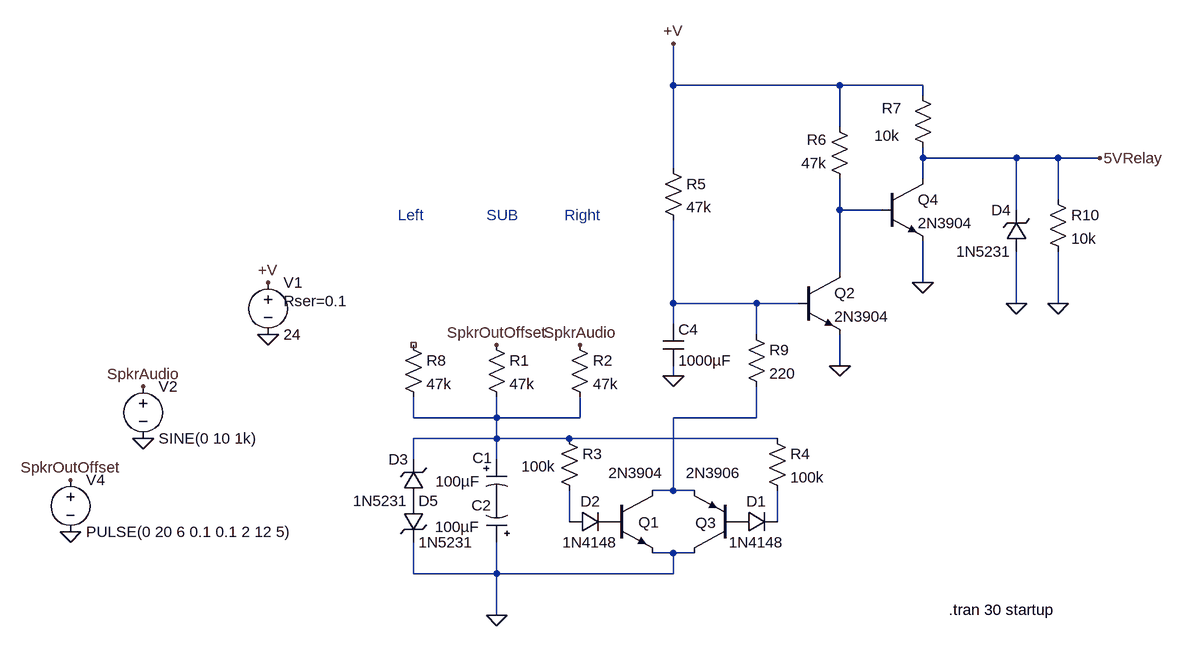
[diagram p0: schematic SpeakerProtection5vOut.asc]
SpeakerProtection5vOut.asc, the LTspice schematic file:
Version 4
SHEET 1 1752 680
WIRE 576 -688 576 -752
WIRE 832 -688 576 -688
WIRE 960 -688 832 -688
WIRE 960 -672 960 -688
WIRE 832 -624 832 -688
WIRE 960 -576 960 -592
WIRE 1104 -576 960 -576
WIRE 1168 -576 1104 -576
WIRE 1232 -576 1168 -576
WIRE 576 -560 576 -688
WIRE 960 -544 960 -576
WIRE 1168 -512 1168 -576
WIRE 832 -496 832 -544
WIRE 896 -496 832 -496
WIRE 1104 -496 1104 -576
WIRE 832 -400 832 -496
WIRE 960 -384 960 -448
WIRE 576 -352 576 -480
WIRE 704 -352 576 -352
WIRE 768 -352 704 -352
WIRE 1104 -352 1104 -432
WIRE 1168 -352 1168 -432
WIRE 576 -320 576 -352
WIRE 704 -304 704 -352
WIRE 832 -256 832 -304
WIRE 576 -240 576 -256
WIRE 176 -176 176 -208
WIRE 304 -176 304 -208
WIRE 304 -176 176 -176
WIRE 432 -176 432 -208
WIRE 432 -176 304 -176
WIRE 704 -176 704 -224
WIRE 704 -176 576 -176
WIRE 304 -144 304 -176
WIRE 304 -144 176 -144
WIRE 416 -144 304 -144
WIRE 736 -144 416 -144
WIRE 176 -112 176 -144
WIRE 304 -112 304 -144
WIRE 576 -64 576 -176
WIRE 576 -64 544 -64
WIRE 608 -64 576 -64
WIRE 416 -16 416 -64
WIRE 736 -16 736 -64
WIRE 576 32 544 32
WIRE 608 32 576 32
WIRE 176 64 176 16
WIRE 304 64 304 16
WIRE 304 64 176 64
WIRE 576 64 576 32
WIRE 576 64 304 64
WIRE 304 128 304 64
FLAG -48 -304 0
FLAG -48 -384 +V
FLAG -352 -80 SpkrOutOffset
FLAG 304 128 0
FLAG 576 -752 +V
FLAG 1232 -576 5VRelay
FLAG -352 0 0
FLAG 832 -256 0
FLAG 1104 -352 0
FLAG 960 -384 0
FLAG 304 -288 SpkrOutOffset
FLAG -240 -144 0
FLAG -240 -224 SpkrAudio
FLAG 432 -288 SpkrAudio
FLAG 1168 -352 0
FLAG 576 -240 0
SYMBOL voltage -48 -400 R0
WINDOW 123 0 0 Left 0
WINDOW 39 24 44 Left 2
SYMATTR SpiceLine Rser=0.1
SYMATTR InstName V1
SYMATTR Value 24
SYMBOL res 288 -304 R0
SYMATTR InstName R1
SYMATTR Value 47k
SYMBOL res 416 -304 R0
SYMATTR InstName R2
SYMATTR Value 47k
SYMBOL polcap 288 -112 R0
WINDOW 0 -21 -2 Left 2
WINDOW 3 -78 34 Left 2
SYMATTR InstName C1
SYMATTR Value 100µF
SYMATTR Description Capacitor
SYMATTR Type cap
SYMATTR SpiceLine V=100 Irms=385m Rser=0.18 Lser=0
SYMBOL polcap 320 16 R180
WINDOW 0 24 57 Left 2
WINDOW 3 42 24 Left 2
SYMATTR InstName C2
SYMATTR Value 100µF
SYMATTR Description Capacitor
SYMATTR Type cap
SYMATTR SpiceLine V=100 Irms=385m Rser=0.18 Lser=0
SYMBOL npn 480 -64 R0
WINDOW 0 42 49 Left 2
WINDOW 3 -4 -27 Left 2
SYMATTR InstName Q1
SYMATTR Value 2N3904
SYMBOL pnp 672 32 R180
WINDOW 0 30 46 Left 2
WINDOW 3 -8 123 Left 2
SYMATTR InstName Q3
SYMATTR Value 2N3906
SYMBOL res 400 -160 R0
WINDOW 3 -58 59 Left 2
SYMATTR Value 100k
SYMATTR InstName R3
SYMBOL res 720 -160 R0
SYMATTR InstName R4
SYMATTR Value 100k
SYMBOL diode 672 0 R270
WINDOW 0 32 32 VTop 2
WINDOW 3 0 32 VBottom 2
SYMATTR InstName D1
SYMATTR Value 1N4148
SYMBOL diode 416 0 R270
WINDOW 0 32 32 VTop 2
WINDOW 3 0 32 VBottom 2
SYMATTR InstName D2
SYMATTR Value 1N4148
SYMBOL res 560 -576 R0
SYMATTR InstName R5
SYMATTR Value 47k
SYMBOL voltage -352 -96 R0
WINDOW 123 0 0 Left 0
SYMATTR InstName V4
SYMATTR Value PULSE(0 20 6 0.1 0.1 2 12 5)
SYMATTR SpiceLine Rser=0.5
SYMBOL npn 768 -400 R0
SYMATTR InstName Q2
SYMATTR Value 2N3904
SYMBOL zener 1120 -432 R180
WINDOW 0 24 64 Left 2
WINDOW 3 24 0 Left 2
SYMATTR InstName D4
SYMATTR Value 1N5231
SYMATTR Description Diode
SYMATTR Type diode
SYMBOL res 848 -528 R180
WINDOW 0 36 76 Left 2
WINDOW 3 36 40 Left 2
SYMATTR InstName R6
SYMATTR Value 47k
SYMBOL npn 896 -544 R0
SYMATTR InstName Q4
SYMATTR Value 2N3904
SYMBOL res 944 -688 R0
WINDOW 0 -47 35 Left 2
WINDOW 3 -59 78 Left 2
SYMATTR InstName R7
SYMATTR Value 10k
SYMBOL voltage -240 -240 R0
WINDOW 123 0 0 Left 0
WINDOW 39 0 0 Left 0
SYMATTR InstName V2
SYMATTR Value SINE(0 10 1k)
SYMBOL res 160 -304 R0
SYMATTR InstName R8
SYMATTR Value 47k
SYMBOL res 1152 -528 R0
SYMATTR InstName R10
SYMATTR Value 10k
SYMBOL cap 560 -320 R0
SYMATTR InstName C4
SYMATTR Value 1000µF
SYMBOL zener 192 -48 R180
WINDOW 0 24 64 Left 2
WINDOW 3 24 0 Left 2
SYMATTR InstName D3
SYMATTR Value 1N5231
SYMATTR Description Diode
SYMATTR Type diode
SYMBOL zener 160 -48 R0
SYMATTR InstName D5
SYMATTR Value 1N5231
SYMATTR Description Diode
SYMATTR Type diode
SYMBOL res 688 -320 R0
SYMATTR InstName R9
SYMATTR Value 220
TEXT 1000 120 Left 2 !.tran 30 startup
TEXT 152 -488 Left 2 ;Left
TEXT 288 -488 Left 2 ;SUB
TEXT 408 -488 Left 2 ;Right

The netlist it stands for:
* SpeakerProtection5vOut.asc
V1 +V 0 24 Rser=0.1
R1 SpkrOutOffset N003 47k
R2 SpkrAudio N003 47k
C1 N003 P001 100µF V=100 Irms=385m Rser=0.18 Lser=0
C2 0 P001 100µF V=100 Irms=385m Rser=0.18 Lser=0
Q1 N004 P002 0 0 2N3904
Q3 0 P003 N004 0 2N3906
R3 N003 N005 100k
R4 N003 N006 100k
D1 P003 N006 1N4148
D2 N005 P002 1N4148
R5 +V N002 47k
V4 SpkrOutOffset 0 PULSE(0 20 6 0.1 0.1 2 12 5) Rser=0.5
Q2 N001 N002 0 0 2N3904
D4 0 5VRelay 1N5231
R6 N001 +V 47k
Q4 5VRelay N001 0 0 2N3904
R7 +V 5VRelay 10k
V2 SpkrAudio 0 SINE(0 10 1k)
R8 NC_01 N003 47k
R10 5VRelay 0 10k
C4 N002 0 1000µF
D3 P004 N003 1N5231
D5 P004 0 1N5231
R9 N002 N004 220
.model D D
.lib standard.dio
.model NPN NPN
.model PNP PNP
.lib standard.bjt
.tran 30 startup
* Left
* SUB
* Right
.backanno
.end